# EAGLE schematic Schema (EAGLE 9.4.0)
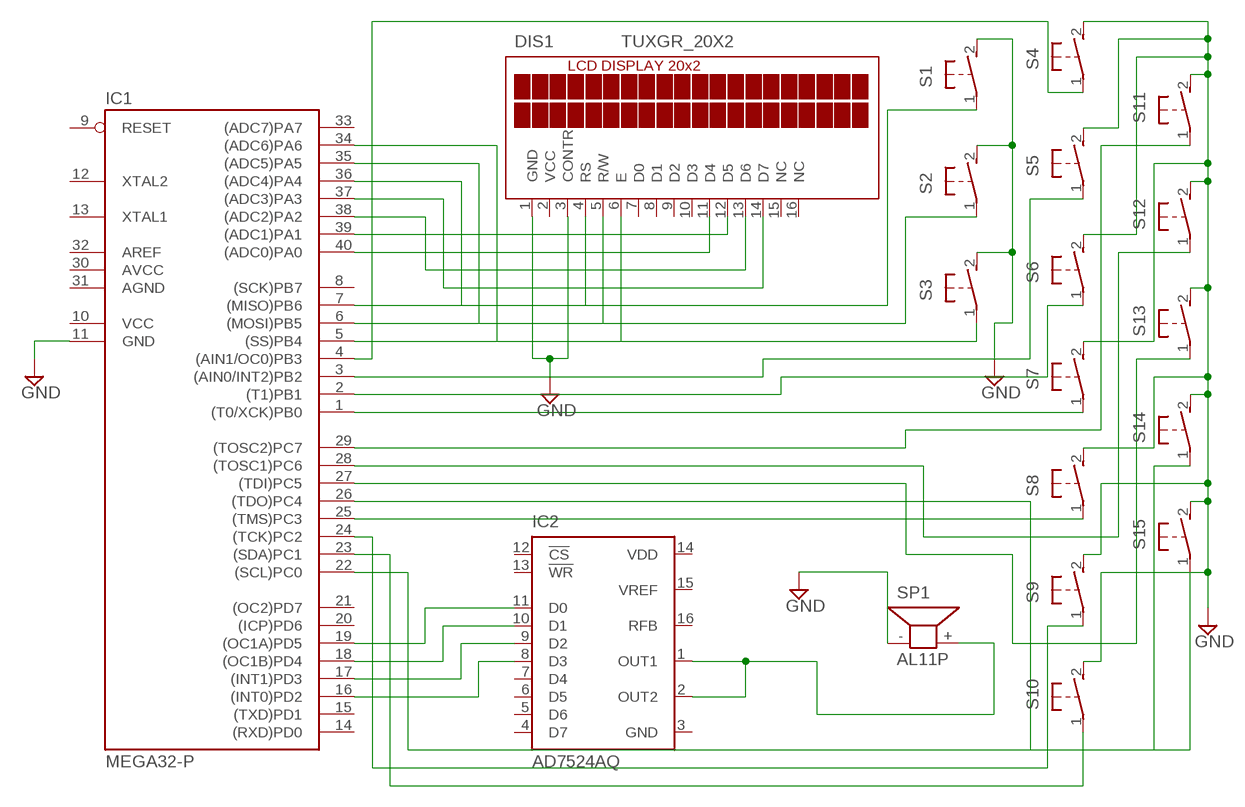
[diagram p0: schematic, sheet 1]

## Parts
DIS1  TUXGR_20X2  [TUXGR_20X2]
IC1  MEGA32-P  [DIL40]
IC2  AD7524AQ  [DIL16]
S1  31-XX  [B3F-31XX]
S2  31-XX  [B3F-31XX]
S3  31-XX  [B3F-31XX]
S4  31-XX  [B3F-31XX]
S5  31-XX  [B3F-31XX]
S6  31-XX  [B3F-31XX]
S7  31-XX  [B3F-31XX]
S8  31-XX  [B3F-31XX]
S9  31-XX  [B3F-31XX]
S10  31-XX  [B3F-31XX]
S11  31-XX  [B3F-31XX]
S12  31-XX  [B3F-31XX]
S13  31-XX  [B3F-31XX]
S14  31-XX  [B3F-31XX]
S15  31-XX  [B3F-31XX]
SP1  AL11P  [AL11P]

## Nets
GND: DIS1.1(GND) DIS1.3(CONTR) IC1.11(GND) S1.2(S) S2.2(S) S3.2(S) S4.2(S) S5.2(S) S6.2(S) S7.2(S) S8.2(S) S9.2(S) S10.2(S) S11.2(S) S12.2(S) S13.2(S) S14.2(S) S15.2(S) SP1.-
N$1: IC1.19((OC1A)PD5) IC2.11(D0)
N$2: IC1.18((OC1B)PD4) IC2.10(D1)
N$3: IC1.17((INT1)PD3) IC2.9(D2)
N$4: IC1.16((INT0)PD2) IC2.8(D3)
N$5: IC2.1(OUT1) IC2.2(OUT2) SP1.+
N$6: DIS1.11(D4) IC1.40((ADC0)PA0)
N$7: DIS1.12(D5) IC1.39((ADC1)PA1)
N$8: DIS1.13(D6) IC1.38((ADC2)PA2)
N$9: DIS1.14(D7) IC1.37((ADC3)PA3)
N$10: DIS1.4(RS) IC1.36((ADC4)PA4)
N$11: DIS1.5(R/W) IC1.35((ADC5)PA5)
N$12: DIS1.6(E) IC1.34((ADC6)PA6)
N$13: IC1.7((MISO)PB6) S1.1(P)
N$14: IC1.6((MOSI)PB5) S2.1(P)
N$15: IC1.5((SS)PB4) S3.1(P)
N$16: IC1.4((AIN1/OC0)PB3) S4.1(P)
N$17: IC1.3((AIN0/INT2)PB2) S5.1(P)
N$18: IC1.2((T1)PB1) S6.1(P)
N$19: IC1.1((T0/XCK)PB0) S7.1(P)
N$20: IC1.29((TOSC2)PC7) S11.1(P)
N$21: IC1.28((TOSC1)PC6) S12.1(P)
N$22: IC1.24((TCK)PC2) S9.1(P)
N$23: IC1.26((TDO)PC4) S14.1(P)
N$24: IC1.25((TMS)PC3) S8.1(P)
N$25: IC1.27((TDI)PC5) S13.1(P)
N$26: IC1.23((SDA)PC1) S10.1(P)
N$27: IC1.22((SCL)PC0) S15.1(P)
Unconnected: DIS1.7(D0) DIS1.8(D1) DIS1.9(D2) DIS1.10(D3) DIS1.15(NC) DIS1.16(NC) IC1.8((SCK)PB7) IC1.9(RESET) IC1.12(XTAL2) IC1.13(XTAL1) IC1.14((RXD)PD0) IC1.15((TXD)PD1) IC1.20((ICP)PD6) IC1.21((OC2)PD7) IC1.33((ADC7)PA7) IC2.4(D7) IC2.5(D6) IC2.6(D5) IC2.7(D4) IC2.12(!CS) IC2.13(!WR) IC2.15(VREF) IC2.16(RFB)

## Power pins joined to a net without a drawn wire
AGND: IC1.31(AGND)
AREF: IC1.32(AREF)
AVCC: IC1.30(AVCC)
GND: IC2.3(GND)
VCC: DIS1.2(VCC) IC1.10(VCC)
VDD: IC2.14(VDD)

## Library data of the parts
DIS1 = display-lcd:TUXGR_20X2: Tuxgraphics LCD display 20x2 characters reflective, without background light Source: tuxgr_20x2.pdf; OC_FARNELL: unknown; OC_NEWARK: unknown
IC1 = avr-7:MEGA32-P: MICROCONTROLLER 32 Kbytes FLASH 2 Kbytes SRAM 1 Kbytes EEPROM USART 8-channel 10 bit ADC
IC2 = analog-devices:AD7524*: 8-Bit Buffered Multiplying DAC Source: http://www.analog.com/UploadedFiles/Data_Sheets/888358036ad7524.pdf; MF: ALTERA CORPORATION; MPN: AD7524AQ; OC_FARNELL: 1464568; OC_NEWARK: 05F7379
S1-S15 = switch-omron:31-XX: OMRON SWITCH; MPN: B3F-3100; OC_FARNELL: 959704; OC_NEWARK: 36M3582
SP1 = buzzer:AL11P: SPEAKER Source: Buerklin; OC_FARNELL: unknown; OC_NEWARK: unknown